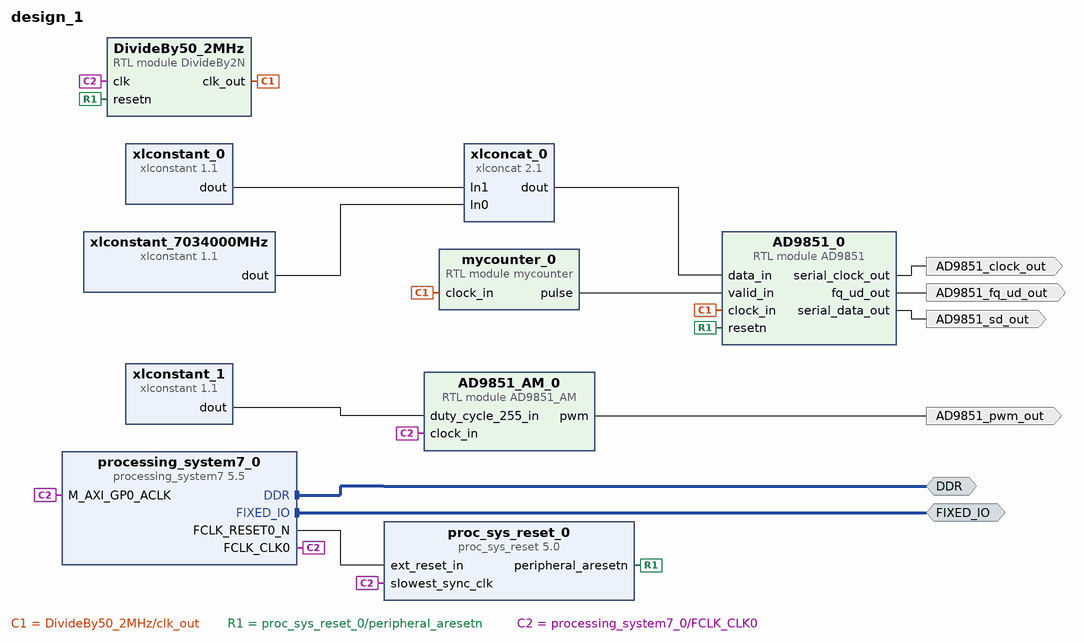
[diagram p0: block diagram of the top level]
# Vivado block design design_1, xc7z010clg400-1, Vivado 2022.2
create_bd_design design_1

create_bd_intf_port -mode Master -vlnv xilinx.com:interface:ddrx_rtl:1.0 DDR
create_bd_intf_port -mode Master -vlnv xilinx.com:display_processing_system7:fixedio_rtl:1.0 FIXED_IO
create_bd_port -dir O AD9851_sd_out
create_bd_port -dir O AD9851_clock_out
create_bd_port -dir O AD9851_fq_ud_out
create_bd_port -dir O AD9851_pwm_out

create_bd_cell -type ip -vlnv xilinx.com:ip:processing_system7:5.5 processing_system7_0
set_property -dict {CONFIG.PCW_FPGA0_PERIPHERAL_FREQMHZ 100} [get_bd_cells processing_system7_0]
# 30 more settings of processing_system7_0 are not shown: defaults, MIO pin electricals, DDR timing, and values the tool derives
create_bd_cell -type ip -vlnv xilinx.com:ip:proc_sys_reset:5.0 proc_sys_reset_0
create_bd_cell -type module -reference AD9851_AM AD9851_AM_0
set_property -dict {CONFIG.PWM_frequency_KHz 200 CONFIG.clock_in_KHz 2000} [get_bd_cells AD9851_AM_0]
create_bd_cell -type ip -vlnv xilinx.com:ip:xlconstant:1.1 xlconstant_7034000MHz
set_property -dict {CONFIG.CONST_VAL 167837778 CONFIG.CONST_WIDTH 32} [get_bd_cells xlconstant_7034000MHz]
create_bd_cell -type ip -vlnv xilinx.com:ip:xlconstant:1.1 xlconstant_0
set_property -dict {CONFIG.CONST_VAL 0b00000001 CONFIG.CONST_WIDTH 8} [get_bd_cells xlconstant_0]
create_bd_cell -type ip -vlnv xilinx.com:ip:xlconstant:1.1 xlconstant_1
set_property -dict {CONFIG.CONST_VAL 60 CONFIG.CONST_WIDTH 8} [get_bd_cells xlconstant_1]
create_bd_cell -type ip -vlnv xilinx.com:ip:xlconcat:2.1 xlconcat_0
set_property -dict {CONFIG.IN0_WIDTH 32 CONFIG.IN1_WIDTH 8} [get_bd_cells xlconcat_0]
create_bd_cell -type module -reference mycounter mycounter_0
set_property -dict {CONFIG.threshold 100} [get_bd_cells mycounter_0]
create_bd_cell -type module -reference DivideBy2N DivideBy50_2MHz
set_property -dict {CONFIG.N 25 CONFIG.WIDTH 8} [get_bd_cells DivideBy50_2MHz]
create_bd_cell -type module -reference AD9851 AD9851_0

# ---- connections ----

connect_bd_intf_net [get_bd_intf_ports DDR] [get_bd_intf_pins processing_system7_0/DDR]
connect_bd_intf_net [get_bd_intf_ports FIXED_IO] [get_bd_intf_pins processing_system7_0/FIXED_IO]
connect_bd_net [get_bd_pins AD9851_0/fq_ud_out] [get_bd_ports AD9851_fq_ud_out]
connect_bd_net [get_bd_pins AD9851_0/serial_clock_out] [get_bd_ports AD9851_clock_out]
connect_bd_net [get_bd_pins AD9851_0/serial_data_out] [get_bd_ports AD9851_sd_out]
connect_bd_net [get_bd_pins AD9851_AM_0/pwm] [get_bd_ports AD9851_pwm_out]
connect_bd_net -net DivideBy10_clk_out [get_bd_pins DivideBy50_2MHz/clk_out] [get_bd_pins mycounter_0/clock_in] [get_bd_pins AD9851_0/clock_in]
connect_bd_net [get_bd_pins mycounter_0/pulse] [get_bd_pins AD9851_0/valid_in]
connect_bd_net [get_bd_pins proc_sys_reset_0/peripheral_aresetn] [get_bd_pins DivideBy50_2MHz/resetn] [get_bd_pins AD9851_0/resetn]
connect_bd_net [get_bd_pins processing_system7_0/FCLK_CLK0] \
  [get_bd_pins proc_sys_reset_0/slowest_sync_clk] [get_bd_pins processing_system7_0/M_AXI_GP0_ACLK] \
  [get_bd_pins AD9851_AM_0/clock_in] [get_bd_pins DivideBy50_2MHz/clk]
connect_bd_net [get_bd_pins processing_system7_0/FCLK_RESET0_N] [get_bd_pins proc_sys_reset_0/ext_reset_in]
connect_bd_net [get_bd_pins xlconcat_0/dout] [get_bd_pins AD9851_0/data_in]
connect_bd_net [get_bd_pins xlconstant_0/dout] [get_bd_pins xlconcat_0/In1]
connect_bd_net [get_bd_pins xlconstant_1/dout] [get_bd_pins AD9851_AM_0/duty_cycle_255_in]
connect_bd_net [get_bd_pins xlconstant_7034000MHz/dout] [get_bd_pins xlconcat_0/In0]

validate_bd_design
save_bd_design
